# EAGLE schematic boiler (EAGLE 9.6.2)
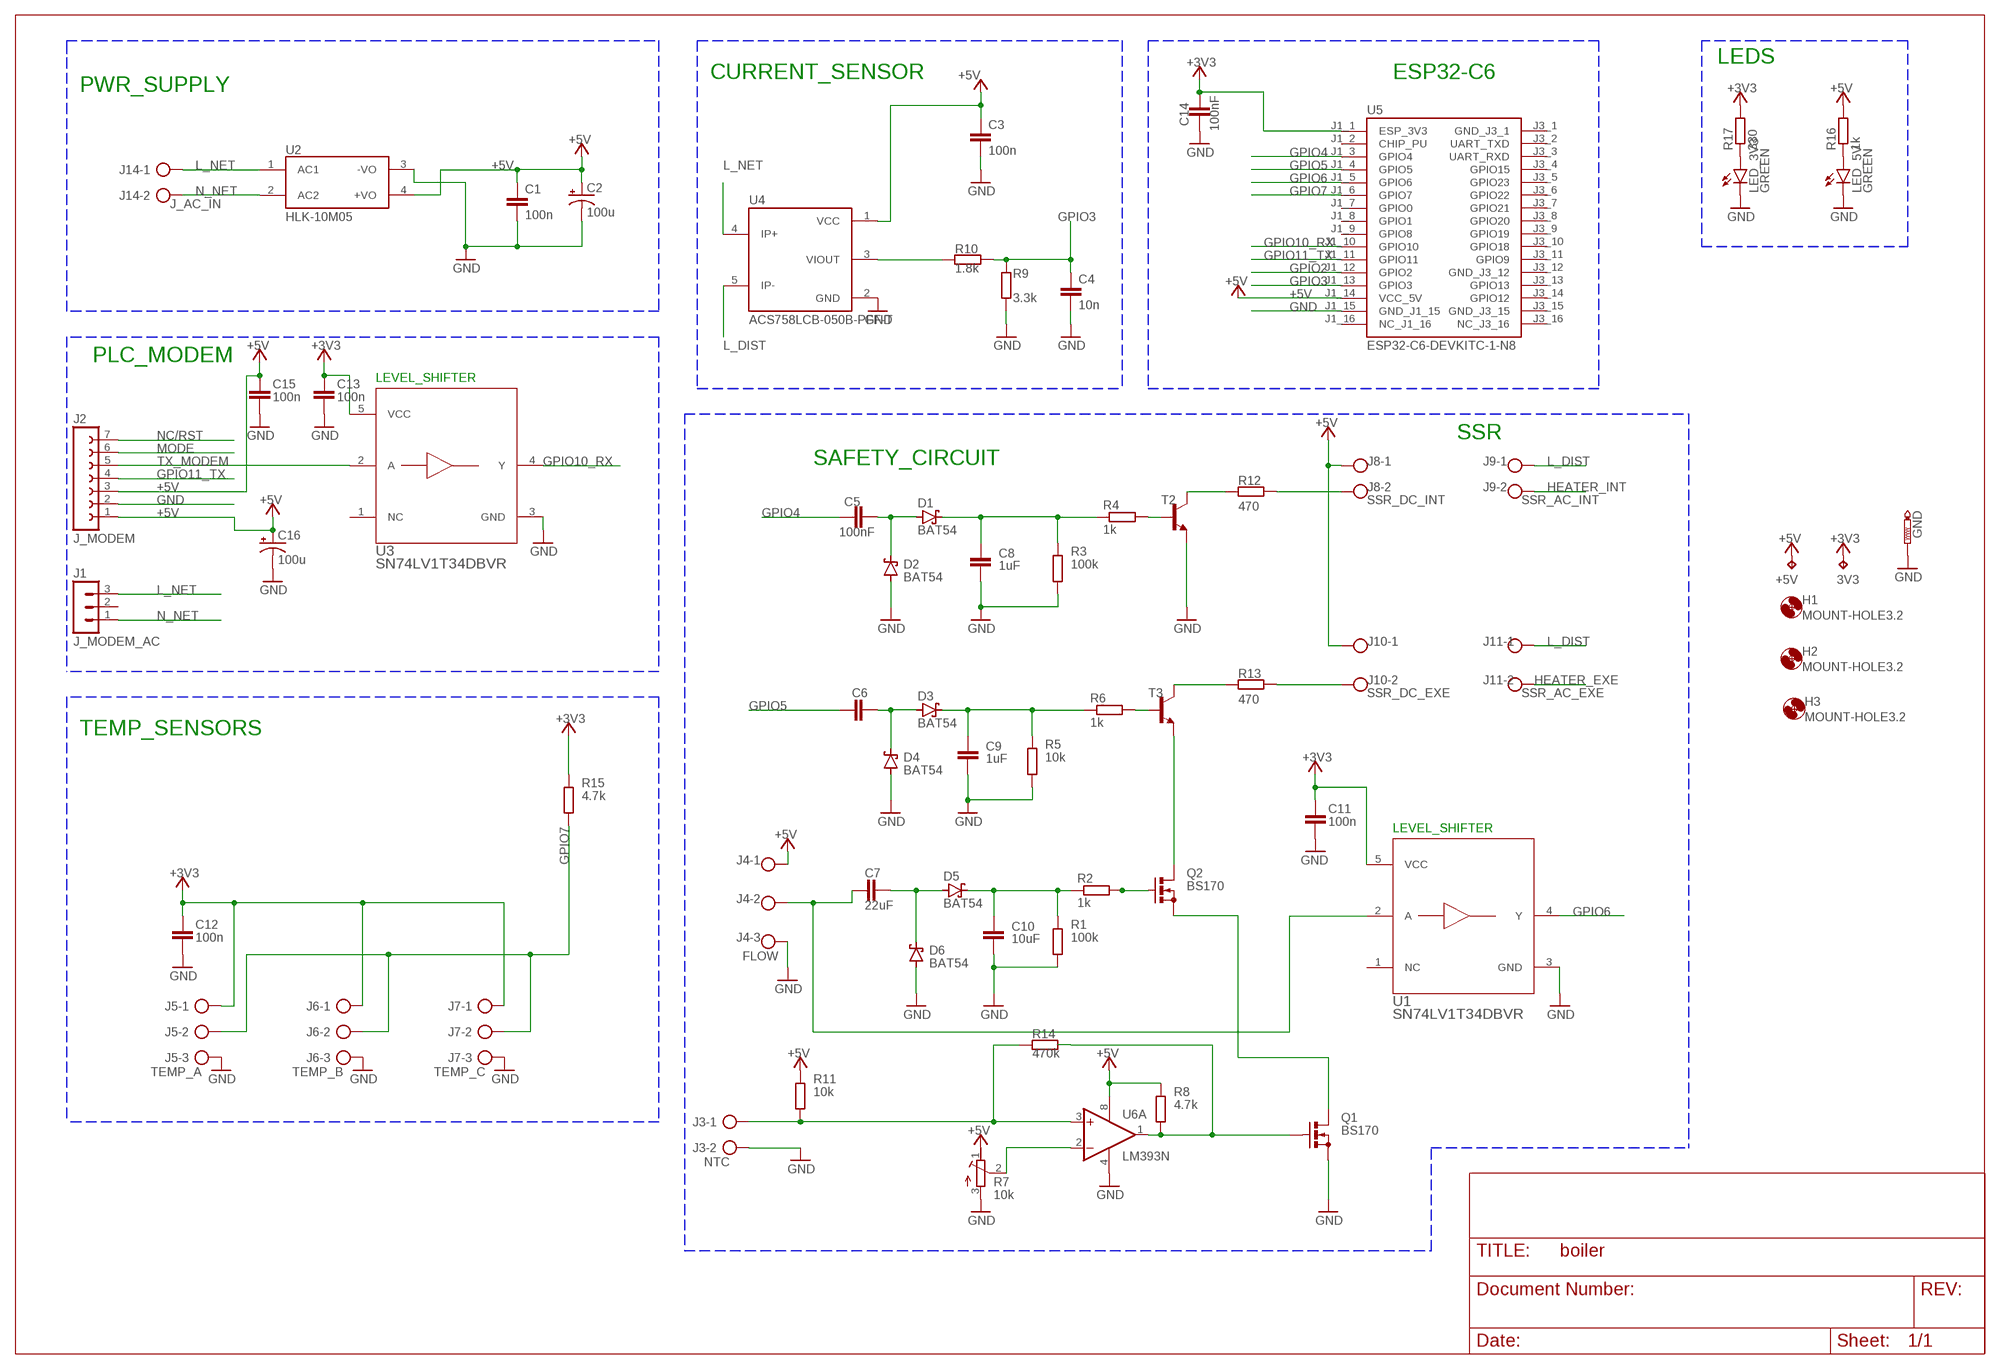
[diagram p0: schematic, sheet 1]

## Parts
3V3  TPB2,54  [B2,54]
+5V  TPB2,54  [B2,54]
C1  100n  C-EUC0603  [C0603]
C2  100u  CPOL-USC  [PANASONIC_C]
C3  100n  C-EUC0603  [C0603]
C4  10n  C-EUC0603  [C0603]
C5  100nF  C-EUC0603  [C0603]
C6  1u  C-EUC0603  [C0603]
C7  22uF  C-EUC0603  [C0603]
C8  1uF  C-EUC0603  [C0603]
C9  1uF  C-EUC0603  [C0603]
C10  10uF  C-EUC0603  [C0603]
C11  100n  C-EUC0603  [C0603]
C12  100n  C-EUC0603  [C0603]
C13  100n  C-EUC0603  [C0603]
C14  100nF  C-EUC0603  [C0603]
C15  100n  C-EUC0603  [C0603]
C16  100u  CPOL-USC  [PANASONIC_C]
D1  BAT54  [SOT23]
D2  BAT54  [SOT23]
D3  BAT54  [SOT23]
D4  BAT54  [SOT23]
D5  BAT54  [SOT23]
D6  BAT54  [SOT23]
GND  PTR1TP15R  [TP15R]
H1  MOUNT-HOLE3.2  [3,2]
H2  MOUNT-HOLE3.2  [3,2]
H3  MOUNT-HOLE3.2  [3,2]
J1  J_MODEM_AC  MA03-1  [MA03-1]
J2  J_MODEM  FE07-1  [FE07]
J3  NTC  AK500/2  [AK500/2]
J4  FLOW  AK500/3  [AK500/3]
J5  TEMP_A  AK500/3  [AK500/3]
J6  TEMP_B  AK500/3  [AK500/3]
J7  TEMP_C  AK500/3  [AK500/3]
J8  SSR_DC_INT  AK500/2  [AK500/2]
J9  SSR_AC_INT  AK500/2  [AK500/2]
J10  SSR_DC_EXE  AK500/2  [AK500/2]
J11  SSR_AC_EXE  AK500/2  [AK500/2]
J14  J_AC_IN  AK500/2  [AK500/2]
LED_3V3  GREEN  LEDCHIPLED_0603  [CHIPLED_0603]
LED_5V  GREEN  LEDCHIPLED_0603  [CHIPLED_0603]
Q1  BS170  [SOT54E]
Q2  BS170  [SOT54E]
R1  100k  R-EU_R0603  [R0603]
R2  1k  R-EU_R0603  [R0603]
R3  100k  R-EU_R0603  [R0603]
R4  1k  R-EU_R0603  [R0603]
R5  10k  R-EU_R0603  [R0603]
R6  1k  R-EU_R0603  [R0603]
R7  10k  R-TRIMM3314G  [RTRIM3314G]
R8  4.7k  R-EU_R0603  [R0603]
R9  3.3k  R-EU_R0603  [R0603]
R10  1.8k  R-EU_R0603  [R0603]
R11  10k  R-EU_R0603  [R0603]
R12  470  R-EU_R0603  [R0603]
R13  470  R-EU_R0603  [R0603]
R14  470k  R-EU_R0603  [R0603]
R15  4.7k  R-EU_R0603  [R0603]
R16  1k  R-EU_R0603  [R0603]
R17  330  R-EU_R0603  [R0603]
T2  2N2222-NPN-TO92-EBC  [TO92-EBC]
T3  2N2222-NPN-TO92-EBC  [TO92-EBC]
U1  SN74LV1T34DBVR  [DBV0005A_N]
U2  HLK-10M05  [CONV_HLK-10M05]
U3  SN74LV1T34DBVR  [DBV0005A_N]
U4  ACS758LCB-050B-PFF-T  [XDCR_ACS758LCB-050B-PFF-T]
U5  ESP32-C6-DEVKITC-1-N8  [MODULE_ESP32-C6-DEVKITC-1-N8]
U6  LM393N  [DIL08]

## Nets
+3V3: 3V3.TP C11.2 C12.2 C13.2 C14.2 J5.1 J6.1 J7.1 R15.2 R17.2 U1.5(VCC) U3.5(VCC) U5.J1_1(ESP_3V3)
+5V: +5V.TP C1.2 C2.+ C3.1 C15.2 C16.+ J2.1 J2.3 J4.1 J8.1 J10.1 R7.1(E) R8.2 R11.2 R16.2 U2.4(+VO) U4.1(VCC) U5.J1_14(VCC_5V) U6.8(P:V+)
GND: C1.1 C2.- C3.2 C4.2 C8.2 C9.2 C10.2 C11.1 C12.1 C13.1 C14.1 C15.1 C16.- D2.1(A) D4.1(A) D6.1(A) GND.TP J2.2 J3.2 J4.3 J5.3 J6.3 J7.3 LED_3V3.C LED_5V.C Q1.S R1.1 R3.1 R5.1 R7.3(A) R9.1 T2.E U1.3(GND) U2.3(-VO) U3.3(GND) U4.2(GND) U5.J1_15(GND_J1_15) U6.4(P:V-)
GPIO2: U5.J1_12(GPIO2)
GPIO3: C4.1 R9.2 R10.1 U5.J1_13(GPIO3)
GPIO4: C5.1 U5.J1_3(GPIO4)
GPIO5: C6.1 U5.J1_4(GPIO5)
GPIO6: U1.4(Y) U5.J1_5(GPIO6)
GPIO7: J5.2 J6.2 J7.2 R15.1 U5.J1_6(GPIO7)
GPIO10_RX: U3.4(Y) U5.J1_10(GPIO10)
GPIO11_TX: J2.4 U5.J1_11(GPIO11)
HEATER_EXE: J11.2
HEATER_INT: J9.2
L_DIST [HV]: J9.1 J11.1 U4.5(IP-)
L_NET [HV]: J1.3 J14.1 U2.1(AC1) U4.4(IP+)
MODE: J2.6
N$1: C7.1 J4.2 U1.2(A)
N$2: C5.2 D1.1(A) D2.3(C)
N$3: C8.1 D1.3(C) R3.2 R4.1
N$4: R4.2 T2.B
N$5: R10.2 U4.3(VIOUT)
N$6: C7.2 D5.1(A) D6.3(C)
N$7: C10.1 D5.3(C) R1.2 R2.1
N$8: Q2.G R2.2
N$9: LED_5V.A R16.1
N$10: C6.2 D3.1(A) D4.3(C)
N$11: C9.1 D3.3(C) R5.2 R6.1
N$12: R6.2 T3.B
N$13: Q2.D T3.E
N$14: R13.2 T3.C
N$15: R12.2 T2.C
N$17: R7.2(S) U6.2(A:-IN)
N$18: Q1.D Q2.S
N$19: J3.1 R11.1 R14.2 U6.3(A:+IN)
N$20: J8.2 R12.1
N$21: J10.2 R13.1
N$22: LED_3V3.A R17.1
N$23: Q1.G R8.1 R14.1 U6.1(A:OUT)
N_NET: J1.1 J14.2 U2.2(AC2)
NC/RST: J2.7
TX_MODEM: J2.5 U3.2(A)
Unconnected: J1.2 U1.1(NC) U3.1(NC) U5.J1_2(CHIP_PU) U5.J1_7(GPIO0) U5.J1_8(GPIO1) U5.J1_9(GPIO8) U5.J1_16(NC_J1_16) U5.J3_2(UART_TXD) U5.J3_3(UART_RXD) U5.J3_4(GPIO15) U5.J3_5(GPIO23) U5.J3_6(GPIO22) U5.J3_7(GPIO21) U5.J3_8(GPIO20) U5.J3_9(GPIO19) U5.J3_10(GPIO18) U5.J3_11(GPIO9) U5.J3_13(GPIO13) U5.J3_14(GPIO12) U5.J3_16(NC_J3_16) U6.5(B:+IN) U6.6(B:-IN) U6.7(B:OUT)

## Notes on the sheet
- LEDS
- CURRENT_SENSOR | ESP32-C6
- PWR_SUPPLY
- PLC_MODEM
- LEVEL_SHIFTER
- SSR
- SAFETY_CIRCUIT
- TEMP_SENSORS
- LEVEL_SHIFTER

## Power pins joined to a net without a drawn wire
GND_J3_1: U5.J3_1(GND_J3_1)
GND_J3_12: U5.J3_12(GND_J3_12)
GND_J3_15: U5.J3_15(GND_J3_15)

## Library data of the parts
3V3 +5V = testpad:TP: Test pad
C1 C3-C15 = rcl:C-EU: CAPACITOR, European symbol; SPICEPREFIX: C
C2 C16 = rcl:CPOL-US: POLARIZED CAPACITOR, American symbol; SPICEPREFIX: C
D1-D6 = diode:BAT54: Schottky Diodes Source: Fairchild .. BAT54.pdf
GND = testpad:PTR1: TEST PIN
H1-H3 = holes:MOUNT-HOLE: MOUNTING HOLE with drill center marker
J1 = con-lstb:MA03-1: PIN HEADER; OC_FARNELL: unknown; OC_NEWARK: unknown
J2 = con-lsta:FE07-1: FEMALE HEADER; OC_FARNELL: unknown; OC_NEWARK: unknown
J3 J8-J11 J14 = con-ptr500:AK500/2: CONNECTOR; OC_FARNELL: unknown; OC_NEWARK: unknown
J4-J7 = con-ptr500:AK500/3: CONNECTOR; OC_FARNELL: unknown; OC_NEWARK: unknown
LED_3V3 LED_5V = led:LED: LED OSRAM: - CHIPLED LG R971, LG N971, LY N971, LG Q971, LY Q971, LO R971, LY R971 LH N974, LH R974 LS Q976, LO Q976, LY Q976 LO Q996 - Hyper CHIPLED LW Q18S LB Q993, LB Q99A, LB R99A - SideLED LS A670, LO A670, LY A670, LG A670, LP A670 LB A673, LV A673, LT A673, LW A673 LH A674 LY A675 LS A676, LA A676, LO A676, LY A676, LW A676 LS A679, LY A679, LG A679 - Hyper Micro SIDELED® LS Y876, LA Y876, LO Y876, LY Y876 LT Y87S - SmartLED LW L88C, LW L88S LB L89C, LB L89S, LG L890 LS L89K, LO L89K, LY L89K LS L896, LA L896, LO L896, LY L896 - TOPLED LS T670, LO T670, LY T670, LG T670, LP T670 LSG T670, LSP T670, LSY T670, LOP T670, LYG T670 LG T671, LOG T671, LSG T671 LB T673, LV T673, LT T673, LW T673 LH T674 LS T676, LA T676, LO T676, LY T676, LB T676, LH T676, LSB T676, LW T676 LB T67C, LV T67C, LT T67C, LS T67K, LO T67K, LY T67K, LW E67C LS E67B, LA E67B, LO E67B, LY E67B, LB E67C, LV E67C, LT E67C LW T67C LS T679, LY T679, LG T679 LS T770, LO T770, LY T770, LG T770, LP T770 LB T773, LV T773, LT T773, LW T773 LH T774 LS E675, LA E675, LY E675, LS T675 LS T776, LA T776, LO T776, LY T776, LB T776 LHGB T686 LT T68C, LB T68C - Hyper Mini TOPLED® LB M676 - Mini TOPLED Santana® LG M470 LS M47K, LO M47K, LY M47K Source: http://www.osram.convergy.de LUXEON: - LUMILED® LXK2-PW12-R00, LXK2-PW12-S00, LXK2-PW14-U00, LXK2-PW14-V00 LXK2-PM12-R00, LXK2-PM12-S00, LXK2-PM14-U00 LXK2-PE12-Q00, LXK2-PE12-R00, LXK2-PE12-S00, LXK2-PE14-T00, LXK2-PE14-U00 LXK2-PB12-K00, LXK2-PB12-L00, LXK2-PB12-M00, LXK2-PB14-N00, LXK2-PB14-P00, LXK2-PB14-Q00 LXK2-PR12-L00, LXK2-PR12-M00, LXK2-PR14-Q00, LXK2-PR14-R00 LXK2-PD12-Q00, LXK2-PD12-R00, LXK2-PD12-S00 LXK2-PH12-R00, LXK2-PH12-S00 LXK2-PL12-P00, LXK2-PL12-Q00, LXK2-PL12-R00 Source: www.luxeon.com KINGBRIGHT: KA-3528ASYC Source: www.kingbright.com
Q1 Q2 = transistor-small-signal:BS170: N-CHANNEL MOS FET
R1-R6 R8-R17 = rcl:R-EU_: RESISTOR, European symbol; SPICEPREFIX: R
R7 = rcl:R-TRIMM: Trimm resistor; SPICEMODEL: X; SPICEPREFIXL: POT
T2 T3 = transistor-neu-to92:*-NPN-: NPN Transistror
U1 U3 = Elad:SN74LV1T34DBVR; COPYRIGHT: Copyright (C) 2026 Ultra Librarian. All rights reserved.; DATASHEET: https://www.ti.com/lit/gpn/sn74lv1t34; DESCRIPTION: Single Power Supply BUFFER Logic Level Shifter (no enable) 5-SOT-23 -40 to 125; MANUFACTURER_NAME: Texas Instruments; MANUFACTURER_PART_NUMBER: SN74LV1T34DBVR; REFDES: RefDes; TYPE: TYPE
U2 = HLK-10M05:HLK-10M05: Check availability <https://pricing.snapeda.com/parts/HLK-10M05/Hi-link/view-part?ref=eda>; AVAILABILITY: Not in stock; CHECK_PRICES: https://www.snapeda.com/parts/HLK-10M05/Hi-link/view-part/?ref=eda; DESCRIPTION: 10W Ultra-Compact Power Module; MF: Hi-link; MP: HLK-10M05; PACKAGE: Package; PRICE: None; SNAPEDA_LINK: https://www.snapeda.com/parts/HLK-10M05/Hi-link/view-part/?ref=snap
U4 = ACS758LCB-050B-PFF-T:ACS758LCB-050B-PFF-T: Check availability <https://pricing.snapeda.com/parts/ACS758LCB-050B-PFF-T/Allegro%20MicroSystems%20LLC/view-part?ref=eda>; AVAILABILITY: In Stock; CHECK_PRICES: https://www.snapeda.com/parts/ACS758LCB-050B-PFF-T/Allegro/view-part/?ref=eda; DESCRIPTION: Current Sensor 50A 1 Channel Hall Effect, Open Loop Bidirectional 5-CB Formed Leads, PFF; MF: Allegro MicroSystems LLC; MP: ACS758LCB-050B-PFF-T; PACKAGE: 5-CB-5 Allegro MicroSystems LLC; PRICE: None; SNAPEDA_LINK: https://www.snapeda.com/parts/ACS758LCB-050B-PFF-T/Allegro/view-part/?ref=snap
U5 = ESP32-C6-DEVKITC-1-N8:ESP32-C6-DEVKITC-1-N8; MANUFACTURER: Espressif Systems; PARTREV: 1.3; STANDARD: Manufacturer Recommendations
U6 = linear:LM393: COMPARATOR

## Net classes
1 HV: clearance 0.762 mm to class 0, clearance 0.762 mm